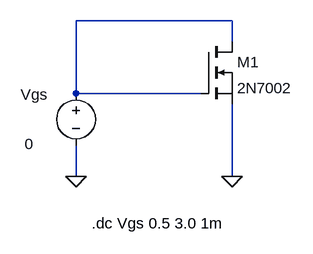
[diagram p0: schematic Question 1.asc]
Question 1.asc, the LTspice schematic file:
Version 4.1
SHEET 1 880 680
WIRE 256 16 16 16
WIRE 256 48 256 16
WIRE 16 128 16 16
WIRE 208 128 16 128
WIRE 16 256 16 208
WIRE 256 256 256 144
FLAG 16 256 0
FLAG 256 256 0
SYMBOL voltage 16 112 R0
WINDOW 0 -85 18 Left 2
WINDOW 3 -79 94 Left 2
SYMATTR InstName Vgs
SYMATTR Value 0
SYMBOL nmos 208 48 R0
SYMATTR InstName M1
SYMATTR Value 2N7002
TEXT 40 328 Left 2 !.dc Vgs 0.5 3.0 1m

The netlist it stands for:
* Question 1.asc
Vgs N001 0 0
M1 N001 N001 0 0 2N7002
.model NMOS NMOS
.model PMOS PMOS
.lib standard.mos
.dc Vgs 0.5 3.0 1m
.backanno
.end